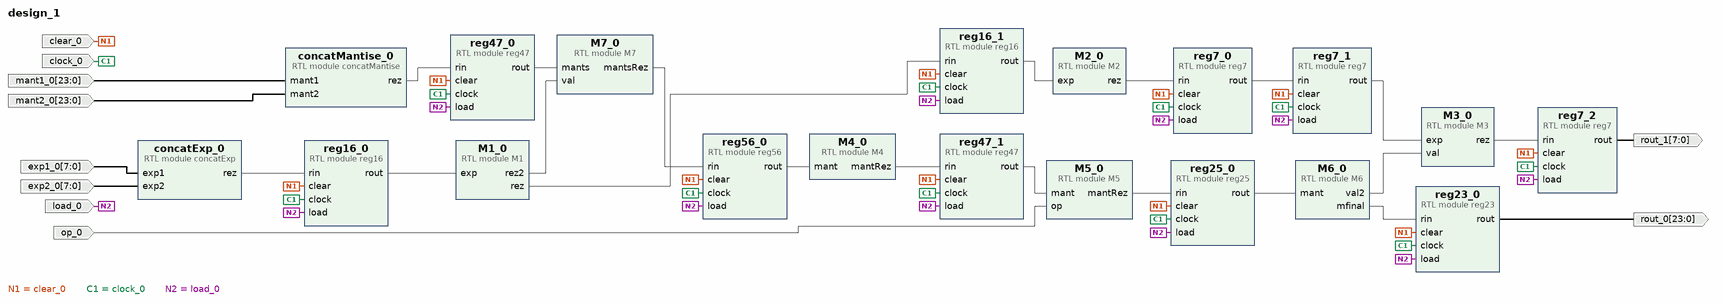
[diagram p0: block diagram of the top level]
# Vivado block design design_1, xc7a100tcsg324-1, Vivado 2020.2
create_bd_design design_1

create_bd_port -dir I -from 23 -to 0 mant1_0
create_bd_port -dir I -from 23 -to 0 mant2_0
create_bd_port -dir I -from 7 -to 0 exp1_0
create_bd_port -dir I -from 7 -to 0 exp2_0
create_bd_port -dir I clear_0
create_bd_port -dir I -type clk clock_0
create_bd_port -dir I load_0
create_bd_port -dir I op_0
create_bd_port -dir O -from 23 -to 0 rout_0
create_bd_port -dir O -from 7 -to 0 rout_1

create_bd_cell -type module -reference concatMantise concatMantise_0
create_bd_cell -type module -reference concatExp concatExp_0
create_bd_cell -type module -reference reg47 reg47_0
create_bd_cell -type module -reference reg16 reg16_0
create_bd_cell -type module -reference M1 M1_0
create_bd_cell -type module -reference M7 M7_0
create_bd_cell -type module -reference reg56 reg56_0
create_bd_cell -type module -reference reg16 reg16_1
create_bd_cell -type module -reference M4 M4_0
create_bd_cell -type module -reference M2 M2_0
create_bd_cell -type module -reference reg47 reg47_1
create_bd_cell -type module -reference reg7 reg7_0
create_bd_cell -type module -reference M5 M5_0
create_bd_cell -type module -reference reg25 reg25_0
create_bd_cell -type module -reference reg7 reg7_1
create_bd_cell -type module -reference M6 M6_0
create_bd_cell -type module -reference M3 M3_0
create_bd_cell -type module -reference reg23 reg23_0
create_bd_cell -type module -reference reg7 reg7_2

# ---- connections ----

connect_bd_net -net mant1_0_1 [get_bd_ports mant1_0] [get_bd_pins concatMantise_0/mant1]
connect_bd_net -net mant2_0_1 [get_bd_ports mant2_0] [get_bd_pins concatMantise_0/mant2]
connect_bd_net -net exp1_0_1 [get_bd_ports exp1_0] [get_bd_pins concatExp_0/exp1]
connect_bd_net -net exp2_0_1 [get_bd_ports exp2_0] [get_bd_pins concatExp_0/exp2]
connect_bd_net -net clear_0_1 [get_bd_ports clear_0] \
  [get_bd_pins reg47_0/clear] [get_bd_pins reg16_0/clear] [get_bd_pins reg56_0/clear] [get_bd_pins reg16_1/clear] \
  [get_bd_pins reg47_1/clear] [get_bd_pins reg7_0/clear] [get_bd_pins reg25_0/clear] [get_bd_pins reg7_1/clear] \
  [get_bd_pins reg23_0/clear] [get_bd_pins reg7_2/clear]
connect_bd_net -net clock_0_1 [get_bd_ports clock_0] \
  [get_bd_pins reg47_0/clock] [get_bd_pins reg16_0/clock] [get_bd_pins reg56_0/clock] [get_bd_pins reg16_1/clock] \
  [get_bd_pins reg47_1/clock] [get_bd_pins reg7_0/clock] [get_bd_pins reg25_0/clock] [get_bd_pins reg7_1/clock] \
  [get_bd_pins reg23_0/clock] [get_bd_pins reg7_2/clock]
connect_bd_net -net load_0_1 [get_bd_ports load_0] \
  [get_bd_pins reg47_0/load] [get_bd_pins reg16_0/load] [get_bd_pins reg56_0/load] [get_bd_pins reg16_1/load] \
  [get_bd_pins reg47_1/load] [get_bd_pins reg7_0/load] [get_bd_pins reg25_0/load] [get_bd_pins reg7_1/load] \
  [get_bd_pins reg23_0/load] [get_bd_pins reg7_2/load]
connect_bd_net [get_bd_pins concatMantise_0/rez] [get_bd_pins reg47_0/rin]
connect_bd_net [get_bd_pins concatExp_0/rez] [get_bd_pins reg16_0/rin]
connect_bd_net [get_bd_pins reg16_0/rout] [get_bd_pins M1_0/exp]
connect_bd_net [get_bd_pins reg47_0/rout] [get_bd_pins M7_0/mants]
connect_bd_net [get_bd_pins M1_0/rez2] [get_bd_pins M7_0/val]
connect_bd_net [get_bd_pins M7_0/mantsRez] [get_bd_pins reg56_0/rin]
connect_bd_net [get_bd_pins M1_0/rez] [get_bd_pins reg16_1/rin]
connect_bd_net [get_bd_pins reg56_0/rout] [get_bd_pins M4_0/mant]
connect_bd_net [get_bd_pins reg16_1/rout] [get_bd_pins M2_0/exp]
connect_bd_net [get_bd_pins M4_0/mantRez] [get_bd_pins reg47_1/rin]
connect_bd_net [get_bd_pins M2_0/rez] [get_bd_pins reg7_0/rin]
connect_bd_net [get_bd_pins reg47_1/rout] [get_bd_pins M5_0/mant]
connect_bd_net -net op_0_1 [get_bd_ports op_0] [get_bd_pins M5_0/op]
connect_bd_net [get_bd_pins M5_0/mantRez] [get_bd_pins reg25_0/rin]
connect_bd_net [get_bd_pins reg7_0/rout] [get_bd_pins reg7_1/rin]
connect_bd_net [get_bd_pins reg25_0/rout] [get_bd_pins M6_0/mant]
connect_bd_net [get_bd_pins reg7_1/rout] [get_bd_pins M3_0/exp]
connect_bd_net [get_bd_pins M6_0/val2] [get_bd_pins M3_0/val]
connect_bd_net [get_bd_pins M6_0/mfinal] [get_bd_pins reg23_0/rin]
connect_bd_net [get_bd_pins M3_0/rez] [get_bd_pins reg7_2/rin]
connect_bd_net [get_bd_pins reg23_0/rout] [get_bd_ports rout_0]
connect_bd_net [get_bd_pins reg7_2/rout] [get_bd_ports rout_1]

validate_bd_design
save_bd_design
